# Altium schematic sheet SCH_HallVoltageLV25np.SchDoc
size A; DocumentNumber: 3; SheetNumber: 3; SheetTotal: 4
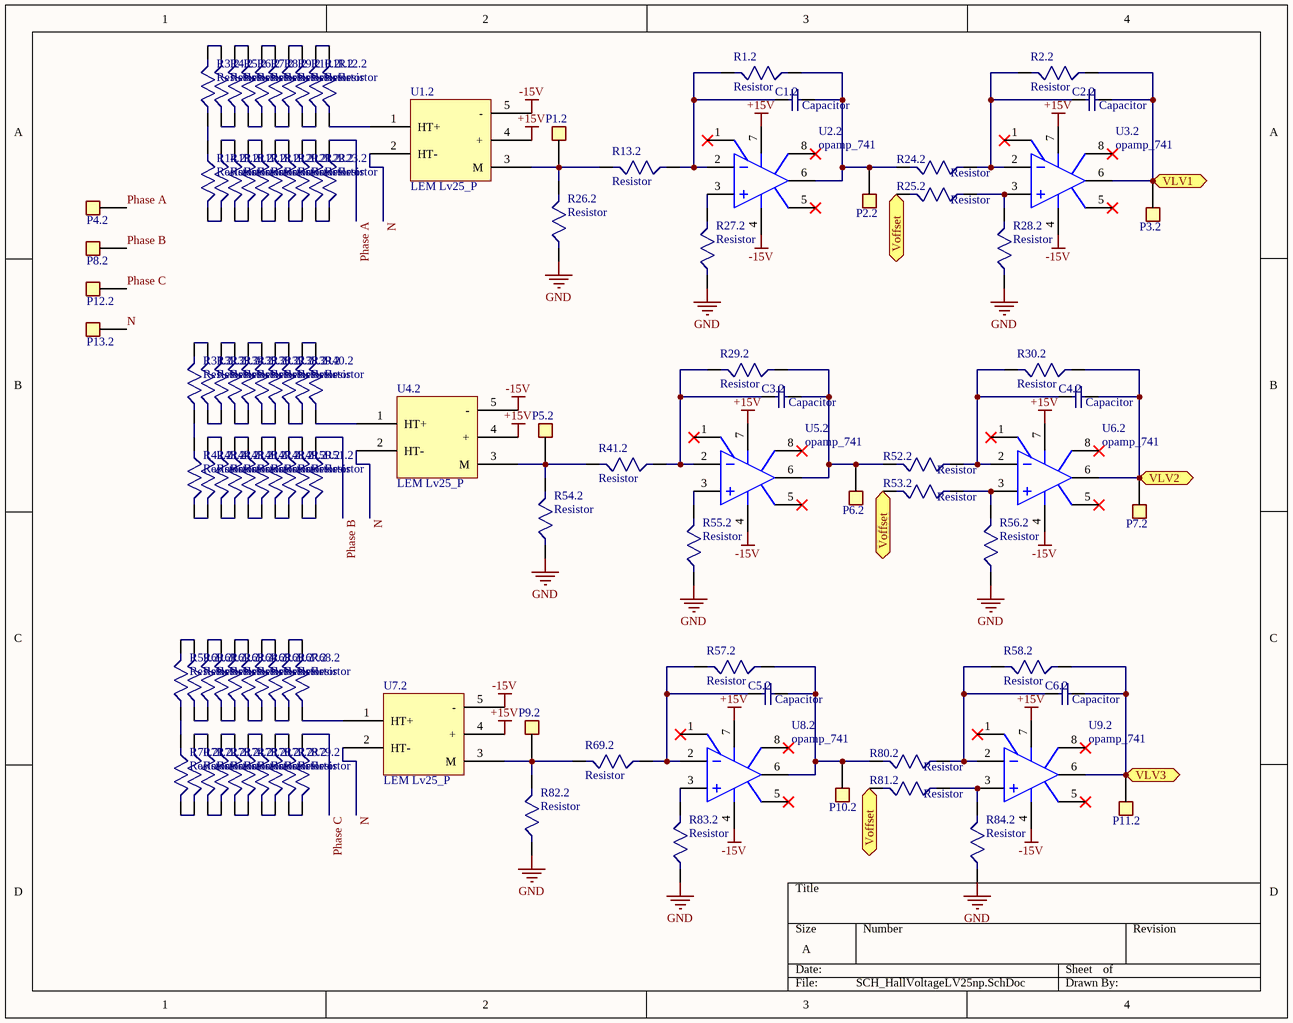
[diagram p0: SCH_HallVoltageLV25np.SchDoc]

## Parts
C1.2  Capacitor  [CAPC0805]
C2.2  Capacitor  [CAPC0805]
C3.2  Capacitor  [CAPC0805]
C4.2  Capacitor  [CAPC0805]
C5.2  Capacitor  [CAPC0805]
C6.2  Capacitor  [CAPC0805]
P1.2  testpin  [tp_red_1p]  (value not drawn)
P2.2  testpin  [tp_red_1p]  (value not drawn)
P3.2  testpin  [tp_red_1p]  (value not drawn)
P4.2  Terminal on PCB  [Terminal M5]  (value not drawn)
P5.2  testpin  [tp_red_1p]  (value not drawn)
P6.2  testpin  [tp_red_1p]  (value not drawn)
P7.2  testpin  [tp_red_1p]  (value not drawn)
P8.2  Terminal on PCB  [Terminal M5]  (value not drawn)
P9.2  testpin  [tp_red_1p]  (value not drawn)
P10.2  testpin  [tp_red_1p]  (value not drawn)
P11.2  testpin  [tp_red_1p]  (value not drawn)
P12.2  Terminal on PCB  [Terminal M5]  (value not drawn)
P13.2  Terminal on PCB  [Terminal M5]  (value not drawn)
R1.2  Resistor  [RESC0805]
R2.2  Resistor  [RESC0805]
R3.2  Resistor  [RESC0805]
R4.2  Resistor  [RESC0805]
R5.2  Resistor  [RESC0805]
R6.2  Resistor  [RESC0805]
R7.2  Resistor  [RESC0805]
R8.2  Resistor  [RESC0805]
R9.2  Resistor  [RESC0805]
R10.2  Resistor  [RESC0805]
R11.2  Resistor  [RESC0805]
R12.2  Resistor  [RESC0805]
R13.2  Resistor  [RESC0805]
R14.2  Resistor  [RESC0805]
R15.2  Resistor  [RESC0805]
R16.2  Resistor  [RESC0805]
R17.2  Resistor  [RESC0805]
R18.2  Resistor  [RESC0805]
R19.2  Resistor  [RESC0805]
R20.2  Resistor  [RESC0805]
R21.2  Resistor  [RESC0805]
R22.2  Resistor  [RESC0805]
R23.2  Resistor  [RESC0805]
R24.2  Resistor  [RESC0805]
R25.2  Resistor  [RESC0805]
R26.2  Resistor  [RESC0805]
R27.2  Resistor  [RESC0805]
R28.2  Resistor  [RESC0805]
R29.2  Resistor  [RESC0805]
R30.2  Resistor  [RESC0805]
R31.2  Resistor  [RESC0805]
R32.2  Resistor  [RESC0805]
R33.2  Resistor  [RESC0805]
R34.2  Resistor  [RESC0805]
R35.2  Resistor  [RESC0805]
R36.2  Resistor  [RESC0805]
R37.2  Resistor  [RESC0805]
R38.2  Resistor  [RESC0805]
R39.2  Resistor  [RESC0805]
R40.2  Resistor  [RESC0805]
R41.2  Resistor  [RESC0805]
R42.2  Resistor  [RESC0805]
R43.2  Resistor  [RESC0805]
R44.2  Resistor  [RESC0805]
R45.2  Resistor  [RESC0805]
R46.2  Resistor  [RESC0805]
R47.2  Resistor  [RESC0805]
R48.2  Resistor  [RESC0805]
R49.2  Resistor  [RESC0805]
R50.2  Resistor  [RESC0805]
R51.2  Resistor  [RESC0805]
R52.2  Resistor  [RESC0805]
R53.2  Resistor  [RESC0805]
R54.2  Resistor  [RESC0805]
R55.2  Resistor  [RESC0805]
R56.2  Resistor  [RESC0805]
R57.2  Resistor  [RESC0805]
R58.2  Resistor  [RESC0805]
R59.2  Resistor  [RESC0805]
R60.2  Resistor  [RESC0805]
R61.2  Resistor  [RESC0805]
R62.2  Resistor  [RESC0805]
R63.2  Resistor  [RESC0805]
R64.2  Resistor  [RESC0805]
R65.2  Resistor  [RESC0805]
R66.2  Resistor  [RESC0805]
R67.2  Resistor  [RESC0805]
R68.2  Resistor  [RESC0805]
R69.2  Resistor  [RESC0805]
R70.2  Resistor  [RESC0805]
R71.2  Resistor  [RESC0805]
R72.2  Resistor  [RESC0805]
R73.2  Resistor  [RESC0805]
R74.2  Resistor  [RESC0805]
R75.2  Resistor  [RESC0805]
R76.2  Resistor  [RESC0805]
R77.2  Resistor  [RESC0805]
R78.2  Resistor  [RESC0805]
R79.2  Resistor  [RESC0805]
R80.2  Resistor  [RESC0805]
R81.2  Resistor  [RESC0805]
R82.2  Resistor  [RESC0805]
R83.2  Resistor  [RESC0805]
R84.2  Resistor  [RESC0805]
U1.2  LEM Lv25_P  [LEN LV25_P]
U2.2  opamp_741  [SOIC-8_dan]
U3.2  opamp_741  [SOIC-8_dan]
U4.2  LEM Lv25_P  [LEN LV25_P]
U5.2  opamp_741  [SOIC-8_dan]
U6.2  opamp_741  [SOIC-8_dan]
U7.2  LEM Lv25_P  [LEN LV25_P]
U8.2  opamp_741  [SOIC-8_dan]
U9.2  opamp_741  [SOIC-8_dan]

## Ports
VLV1, VLV2, VLV3, Voffset

## Nets
+15V: U1.2.4(+) U2.2.7(V+) U3.2.7(V+) U4.2.4(+) U5.2.7(V+) U6.2.7(V+) U7.2.4(+) U8.2.7(V+) U9.2.7(V+)
-15V: U1.2.5(-) U2.2.4(V-) U3.2.4(V-) U4.2.5(-) U5.2.4(V-) U6.2.4(V-) U7.2.5(-) U8.2.4(V-) U9.2.4(V-)
GND: R26.2.1 R27.2.1 R28.2.1 R54.2.1 R55.2.1 R56.2.1 R82.2.1 R83.2.1 R84.2.1
N: P13.2.1 U1.2.2(HT-) U4.2.2(HT-) U7.2.2(HT-)
Phase A: P4.2.1 R23.2.1
Phase B: P8.2.1 R51.2.1
Phase C: P12.2.1 R79.2.1
VLV1: C2.2.2 P3.2.1 R2.2.1 U3.2.6(OUT) ; port VLV1
VLV2: C4.2.2 P7.2.1 R30.2.1 U6.2.6(OUT) ; port VLV2
VLV3: C6.2.2 P11.2.1 R58.2.1 U9.2.6(OUT) ; port VLV3
Voffset: R25.2.2 R53.2.2 R81.2.2 ; port Voffset
NetC1.2_1: C1.2.1 R1.2.2 R13.2.1 U2.2.2(IN-)
NetC1.2_2: C1.2.2 P2.2.1 R1.2.1 R24.2.2 U2.2.6(OUT)
NetC2.2_1: C2.2.1 R2.2.2 R24.2.1 U3.2.2(IN-)
NetC3.2_1: C3.2.1 R29.2.2 R41.2.1 U5.2.2(IN-)
NetC3.2_2: C3.2.2 P6.2.1 R29.2.1 R52.2.2 U5.2.6(OUT)
NetC4.2_1: C4.2.1 R30.2.2 R52.2.1 U6.2.2(IN-)
NetC5.2_1: C5.2.1 R57.2.2 R69.2.1 U8.2.2(IN-)
NetC5.2_2: C5.2.2 P10.2.1 R57.2.1 R80.2.2 U8.2.6(OUT)
NetC6.2_1: C6.2.1 R58.2.2 R80.2.1 U9.2.2(IN-)
NetP1.2_1: P1.2.1 R13.2.2 R26.2.2 U1.2.3(M)
NetP5.2_1: P5.2.1 R41.2.2 R54.2.2 U4.2.3(M)
NetP9.2_1: P9.2.1 R69.2.2 R82.2.2 U7.2.3(M)
NetR3.2_1: R3.2.1 R14.2.1
NetR3.2_2: R3.2.2 R4.2.2
NetR4.2_1: R4.2.1 R5.2.1
NetR5.2_2: R5.2.2 R6.2.2
NetR6.2_1: R6.2.1 R7.2.1
NetR7.2_2: R7.2.2 R8.2.2
NetR8.2_1: R8.2.1 R9.2.1
NetR9.2_2: R9.2.2 R10.2.2
NetR10.2_1: R10.2.1 R11.2.1
NetR11.2_2: R11.2.2 R12.2.2
NetR12.2_1: R12.2.1 U1.2.1(HT+)
NetR14.2_2: R14.2.2 R15.2.2
NetR15.2_1: R15.2.1 R16.2.1
NetR16.2_2: R16.2.2 R17.2.2
NetR17.2_1: R17.2.1 R18.2.1
NetR18.2_2: R18.2.2 R19.2.2
NetR19.2_1: R19.2.1 R20.2.1
NetR20.2_2: R20.2.2 R21.2.2
NetR21.2_1: R21.2.1 R22.2.1
NetR22.2_2: R22.2.2 R23.2.2
NetR25.2_1: R25.2.1 R28.2.2 U3.2.3(IN+)
NetR27.2_2: R27.2.2 U2.2.3(IN+)
NetR31.2_1: R31.2.1 R42.2.1
NetR31.2_2: R31.2.2 R32.2.2
NetR32.2_1: R32.2.1 R33.2.1
NetR33.2_2: R33.2.2 R34.2.2
NetR34.2_1: R34.2.1 R35.2.1
NetR35.2_2: R35.2.2 R36.2.2
NetR36.2_1: R36.2.1 R37.2.1
NetR37.2_2: R37.2.2 R38.2.2
NetR38.2_1: R38.2.1 R39.2.1
NetR39.2_2: R39.2.2 R40.2.2
NetR40.2_1: R40.2.1 U4.2.1(HT+)
NetR42.2_2: R42.2.2 R43.2.2
NetR43.2_1: R43.2.1 R44.2.1
NetR44.2_2: R44.2.2 R45.2.2
NetR45.2_1: R45.2.1 R46.2.1
NetR46.2_2: R46.2.2 R47.2.2
NetR47.2_1: R47.2.1 R48.2.1
NetR48.2_2: R48.2.2 R49.2.2
NetR49.2_1: R49.2.1 R50.2.1
NetR50.2_2: R50.2.2 R51.2.2
NetR53.2_1: R53.2.1 R56.2.2 U6.2.3(IN+)
NetR55.2_2: R55.2.2 U5.2.3(IN+)
NetR59.2_1: R59.2.1 R70.2.1
NetR59.2_2: R59.2.2 R60.2.2
NetR60.2_1: R60.2.1 R61.2.1
NetR61.2_2: R61.2.2 R62.2.2
NetR62.2_1: R62.2.1 R63.2.1
NetR63.2_2: R63.2.2 R64.2.2
NetR64.2_1: R64.2.1 R65.2.1
NetR65.2_2: R65.2.2 R66.2.2
NetR66.2_1: R66.2.1 R67.2.1
NetR67.2_2: R67.2.2 R68.2.2
NetR68.2_1: R68.2.1 U7.2.1(HT+)
NetR70.2_2: R70.2.2 R71.2.2
NetR71.2_1: R71.2.1 R72.2.1
NetR72.2_2: R72.2.2 R73.2.2
NetR73.2_1: R73.2.1 R74.2.1
NetR74.2_2: R74.2.2 R75.2.2
NetR75.2_1: R75.2.1 R76.2.1
NetR76.2_2: R76.2.2 R77.2.2
NetR77.2_1: R77.2.1 R78.2.1
NetR78.2_2: R78.2.2 R79.2.2
NetR81.2_1: R81.2.1 R84.2.2 U9.2.3(IN+)
NetR83.2_2: R83.2.2 U8.2.3(IN+)

Not connected (* = marked no-connect by the designer): U2.2 1(VOSTRIM)* 5(NC)* 8(VOSTRIM)*; U3.2 1(VOSTRIM)* 5(NC)* 8(VOSTRIM)*; U5.2 1(VOSTRIM)* 5(NC)* 8(VOSTRIM)*; U6.2 1(VOSTRIM)* 5(NC)* 8(VOSTRIM)*; U8.2 1(VOSTRIM)* 5(NC)* 8(VOSTRIM)*; U9.2 1(VOSTRIM)* 5(NC)* 8(VOSTRIM)*

## Library data of the parts
C1.2 C2.2 C3.2 C4.2 C5.2 C6.2 = capacitor_non_polar: capacitor non polar
U2.2 U3.2 U5.2 U6.2 U8.2 U9.2 = opamp 741